# EAGLE schematic airball_sensor_board_v1 (EAGLE 8.2.2)
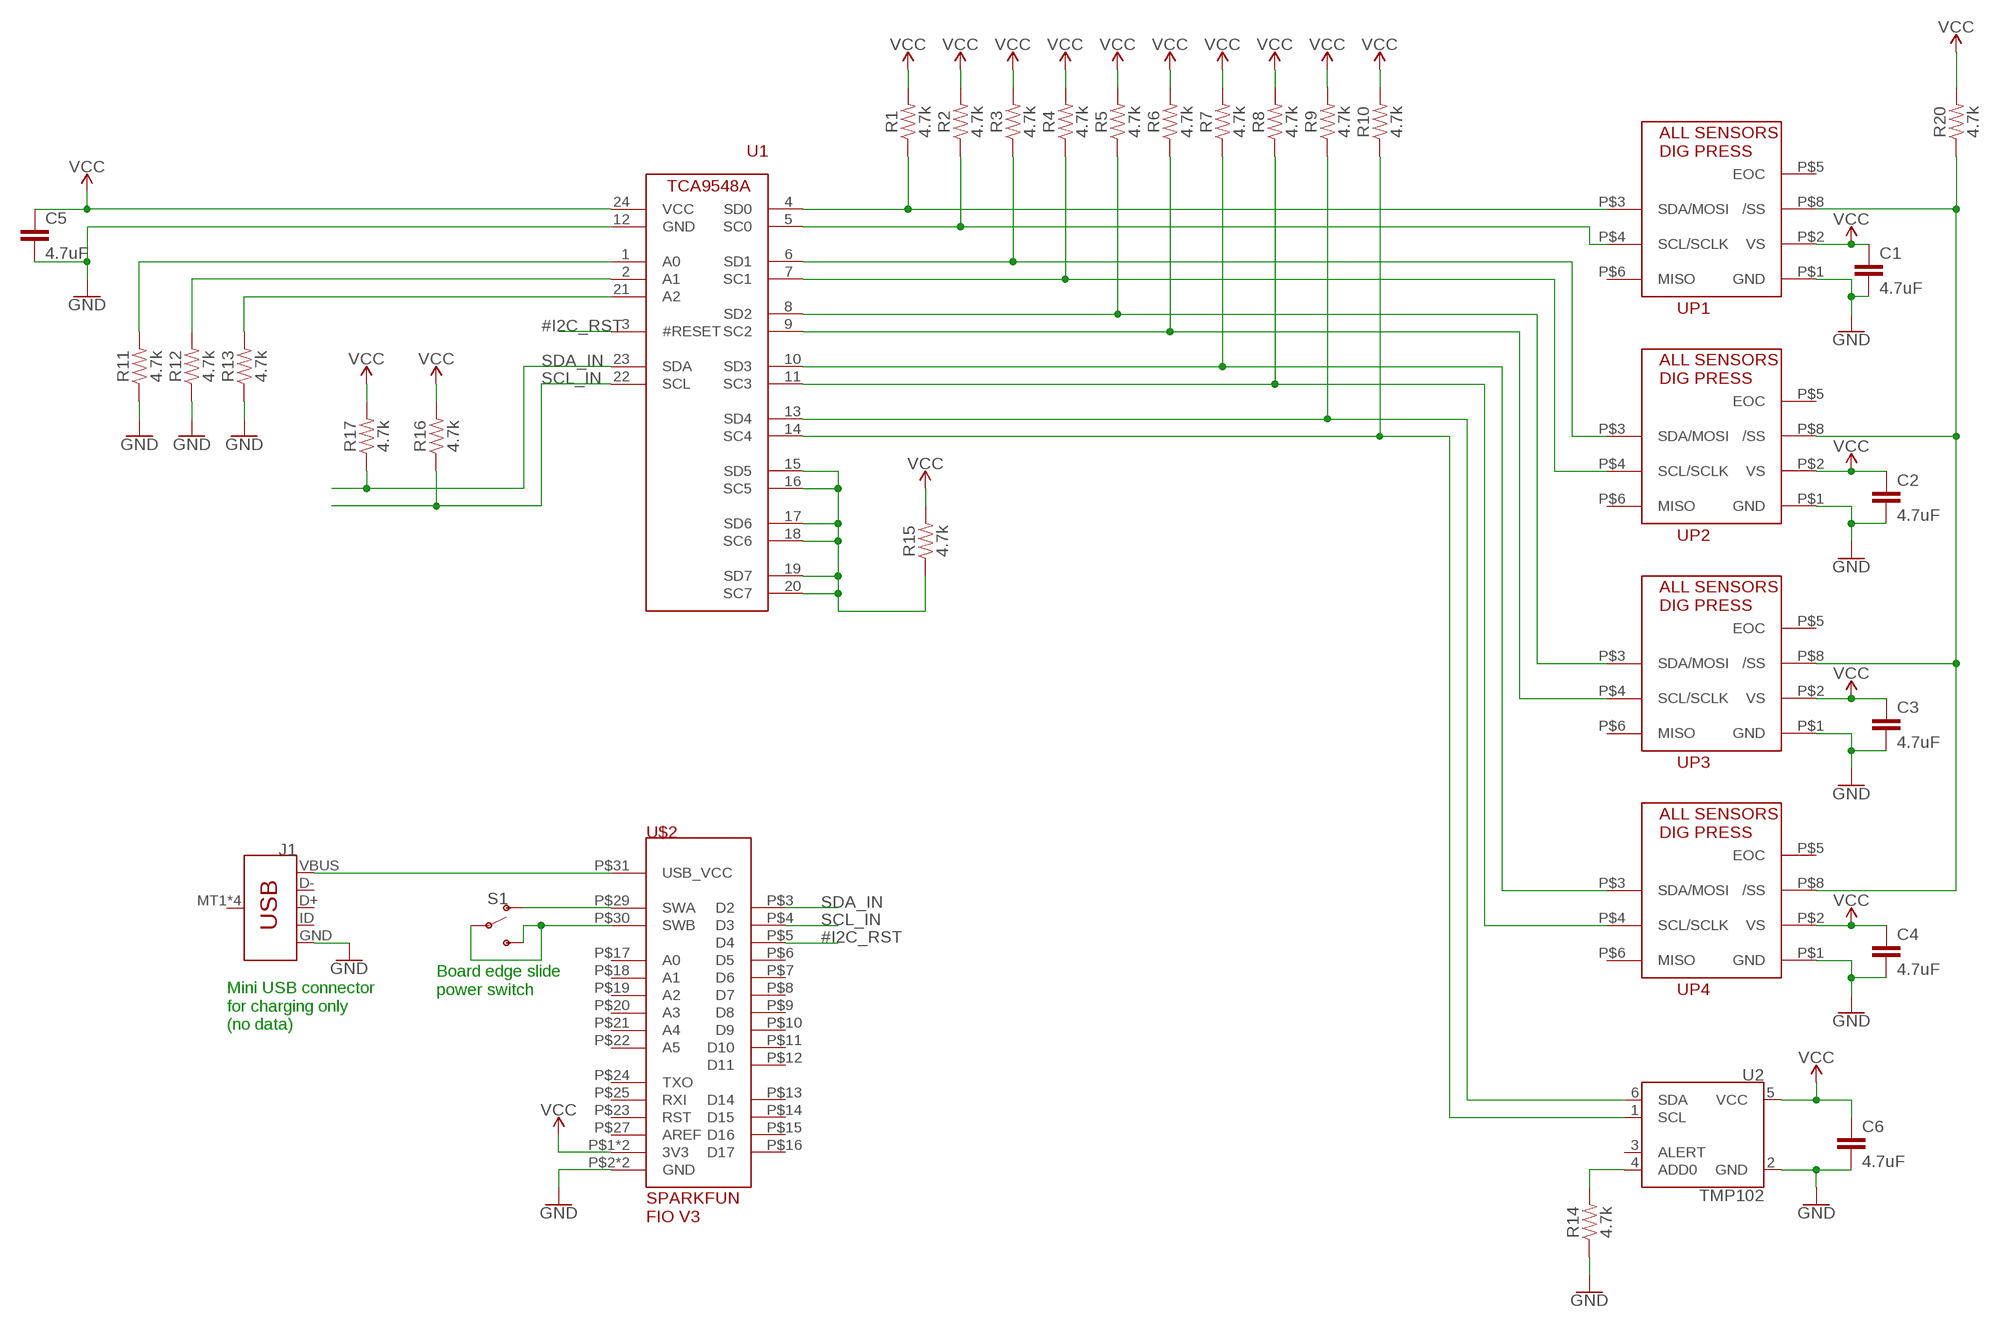
[diagram p0: schematic, sheet 1]

## Parts
C1  4.7uF  4.7UF0603  [0603]
C2  4.7uF  4.7UF0603  [0603]
C3  4.7uF  4.7UF0603  [0603]
C4  4.7uF  4.7UF0603  [0603]
C5  4.7uF  4.7UF0603  [0603]
C6  4.7uF  4.7UF0603  [0603]
J1  USB_MICRO-B_SMT  [USB-MICROB]
R1  4.7k  4.7KOHM-0603-1/10W-1%  [0603]
R2  4.7k  4.7KOHM-0603-1/10W-1%  [0603]
R3  4.7k  4.7KOHM-0603-1/10W-1%  [0603]
R4  4.7k  4.7KOHM-0603-1/10W-1%  [0603]
R5  4.7k  4.7KOHM-0603-1/10W-1%  [0603]
R6  4.7k  4.7KOHM-0603-1/10W-1%  [0603]
R7  4.7k  4.7KOHM-0603-1/10W-1%  [0603]
R8  4.7k  4.7KOHM-0603-1/10W-1%  [0603]
R9  4.7k  4.7KOHM-0603-1/10W-1%  [0603]
R10  4.7k  4.7KOHM-0603-1/10W-1%  [0603]
R11  4.7k  4.7KOHM-0603-1/10W-1%  [0603]
R12  4.7k  4.7KOHM-0603-1/10W-1%  [0603]
R13  4.7k  4.7KOHM-0603-1/10W-1%  [0603]
R14  4.7k  4.7KOHM-0603-1/10W-1%  [0603]
R15  4.7k  4.7KOHM-0603-1/10W-1%  [0603]
R16  4.7k  4.7KOHM-0603-1/10W-1%  [0603]
R17  4.7k  4.7KOHM-0603-1/10W-1%  [0603]
R20  4.7k  4.7KOHM-0603-1/10W-1%  [0603]
S1  SWITCH-SPDT-SMD-RIGHT-ANGLE  [SWITCH_SPST_SMD_A]
U1  TCA9548ATSSOP24  [TSSOP24]
U2  TMP102  [SOT563]
U$2  SPARKFUN_FIO_V3  [SPARKFUN_FIO_V3]
UP1  ALL_SENSORS_DLHR_E1ND  [ALL_SENSORS_E1BD_8PIN_THRU]
UP2  ALL_SENSORS_DLHR_E1ND  [ALL_SENSORS_E1BD_8PIN_THRU]
UP3  ALL_SENSORS_DLHR_E1ND  [ALL_SENSORS_E1BD_8PIN_THRU]
UP4  ALL_SENSORS_DLHR_E1ND  [ALL_SENSORS_E1BD_8PIN_THRU]

## Nets
#I2C_RST: U1.3(#RESET) U$2.P$5(D4)
GND: C1.2 C2.2 C3.2 C4.2 C5.2 C6.2 J1.GND R11.1 R12.1 R13.1 R14.1 U1.12(GND) U2.2(GND) U$2.P$2(GND) U$2.P$28(GND) UP1.P$1(GND) UP2.P$1(GND) UP3.P$1(GND) UP4.P$1(GND)
N$1: R1.1 U1.4(SD0) UP1.P$3(SDA/MOSI)
N$2: R2.1 U1.5(SC0) UP1.P$4(SCL/SCLK)
N$3: R3.1 U1.6(SD1) UP2.P$3(SDA/MOSI)
N$4: R4.1 U1.7(SC1) UP2.P$4(SCL/SCLK)
N$5: R5.1 U1.8(SD2) UP3.P$3(SDA/MOSI)
N$6: R6.1 U1.9(SC2) UP3.P$4(SCL/SCLK)
N$7: R7.1 U1.10(SD3) UP4.P$3(SDA/MOSI)
N$8: R8.1 U1.11(SC3) UP4.P$4(SCL/SCLK)
N$9: S1.1(O) U$2.P$29(SWA)
N$10: J1.VBUS U$2.P$31(USB_VCC)
N$12: R13.2 U1.21(A2)
N$13: R12.2 U1.2(A1)
N$14: R11.2 U1.1(A0)
N$15: R20.1 UP1.P$8(/SS) UP2.P$8(/SS) UP3.P$8(/SS) UP4.P$8(/SS)
N$16: R9.1 U1.13(SD4) U2.6(SDA)
N$17: R10.1 U1.14(SC4) U2.1(SCL)
N$18: S1.2(P) S1.3(S) U$2.P$30(SWB)
N$19: R14.2 U2.4(ADD0)
N$28: R15.1 U1.15(SD5) U1.16(SC5) U1.17(SD6) U1.18(SC6) U1.19(SD7) U1.20(SC7)
SCL_IN: R16.1 U1.22(SCL) U$2.P$4(D3)
SDA_IN: R17.1 U1.23(SDA) U$2.P$3(D2)
VCC: C1.1 C2.1 C3.1 C4.1 C5.1 C6.1 R1.2 R2.2 R3.2 R4.2 R5.2 R6.2 R7.2 R8.2 R9.2 R10.2 R15.2 R16.2 R17.2 R20.2 U1.24(VCC) U2.5(VCC) U$2.P$1(3V3) U$2.P$26(3V3) UP1.P$2(VS) UP2.P$2(VS) UP3.P$2(VS) UP4.P$2(VS)
Unconnected: J1.D+ J1.D- J1.ID J1.MT1(SHIELD) J1.MT2(SHIELD) J1.P$1(SHIELD) J1.P$2(SHIELD) U2.3(ALERT) U$2.P$6(D5) U$2.P$7(D6) U$2.P$8(D7) U$2.P$9(D8) U$2.P$10(D9) U$2.P$11(D10) U$2.P$12(D11) U$2.P$13(D14) U$2.P$14(D15) U$2.P$15(D16) U$2.P$16(D17) U$2.P$17(A0) U$2.P$18(A1) U$2.P$19(A2) U$2.P$20(A3) U$2.P$21(A4) U$2.P$22(A5) U$2.P$23(RST) U$2.P$24(TXO) U$2.P$25(RXI) U$2.P$27(AREF) UP1.P$5(EOC) UP1.P$6(MISO) UP2.P$5(EOC) UP2.P$6(MISO) UP3.P$5(EOC) UP3.P$6(MISO) UP4.P$5(EOC) UP4.P$6(MISO)

## Notes on the sheet
- Board edge slide
  power switch
- Mini USB connector
  for charging only
  (no data)

## Library data of the parts
C1-C6 = SparkFun-Capacitors:4.7UF: 4.7µF ceramic capacitors A capacitor is a passive two-terminal electrical component used to store electrical energy temporarily in an electric field.; PROD_ID: CAP-08280
J1 = SparkFun-Connectors:USB_MICRO-B: USB Type Micro-B Connector Male/female and PTH/SMT variants SparkFun Products: SparkFun microB USB Breakout <https://www.sparkfun.com/products/12035> SparkFun USB microB Plug Breakout <https://www.sparkfun.com/products/10031> SparkFun ESP8266 Thing <https://www.sparkfun.com/products/13231>; PROD_ID: CONN-09505; SF_ID: PRT-08533
R1-R17 R20 = SparkFun-Resistors:4.7KOHM: 4.7kΩ resistor A resistor is a passive two-terminal electrical component that implements electrical resistance as a circuit element. Resistors act to reduce current flow, and, at the same time, act to lower voltage levels within circuits. - Wikipedia; PROD_ID: RES-07857
S1 = SparkFun-Switches:SWITCH-SPDT: Single Pole, Double Throw (SPDT) Switch Single-pole, double-throw (SPDT) switch. Variant Overview SMD-AYZ0202 Surface Mount DPDT Switch <https://www.sparkfun.com/products/597> (COM-00597) Used on e.g. LilyPad Arduino USB - ATmega32U4 Board <https://www.sparkfun.com/products/12049> PTH-11.6X4.0MM SPDT Mini Power Switch <https://www.sparkfun.com/products/102> (COM-00102) Used on e.g. SparkFun Simon Says - Through-Hole Soldering Kit <https://www.sparkfun.com/products/10547> (KIT-10547) PTH-11.6X4.0MM-KIT KIT version of SPDT Mini Power Switch - Simplifies soldering by removing tStop of switch pins - only one side can be soldered. PTH-11.6X4.0MM-LOCK LOCK version of SPDT Mini Power Switch - Offset pins hold switch in place for easier soldering. SMD-RIGHT-ANGLE Surface Mount Right Angle Switch <https://www.sparkfun.com/products/10860> (COM-10860) Used on e.g. SparkFun ESP8266 Thing <https://www.sparkfun.com/products/13231>; PROD_ID: SWCH-10651; SF_SKU: COM-10860
U1 = microbuilder:TCA9548A: Texas Instruments TCA9548A 1-to-8 I2C multiplexer. Supported packages: TSSOP24
U2 = SparkFun-Sensors:TMP102: Texas Instruments TMP102 Low-Power Digital Temperature Sensor The TMP102 is a digital sensor (I2C a.k.a. TWI), has a resolution of 0.0625°C, and is accurate up to 0.5°C. This is a very handy sensor that requires a very low-current. Datasheet <http://www.sparkfun.com/datasheets/Sensors/Temperature/tmp102.pdf> SparkFun Products SparkFun Digital Temperature Sensor Breakout - TMP102 <https://www.sparkfun.com/products/11931> (SEN-11931); PROD_ID: IC-09303
U$2 = microbuilder:SPARKFUN_FIO_V3
UP1-UP4 = microbuilder:ALL_SENSORS_DLHR_E1ND: All Sensors DLHR sensor, E1ND package 8 pin DIP 100 mil pin spacing 600 mil between pin rows 2 barbed pressure ports, same side